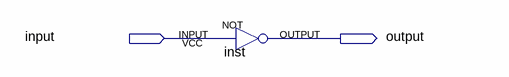
[diagram p0: schematic sheet]
// Quartus schematic inv.bdf as structural Verilog: 1 symbols, 2 pins
module inv (
  input  \input ,
  output \output 
);

  not inst (\output , \input );
endmodule
